# EAGLE board keyBoard_A (EAGLE 6.3), part 1 of 2
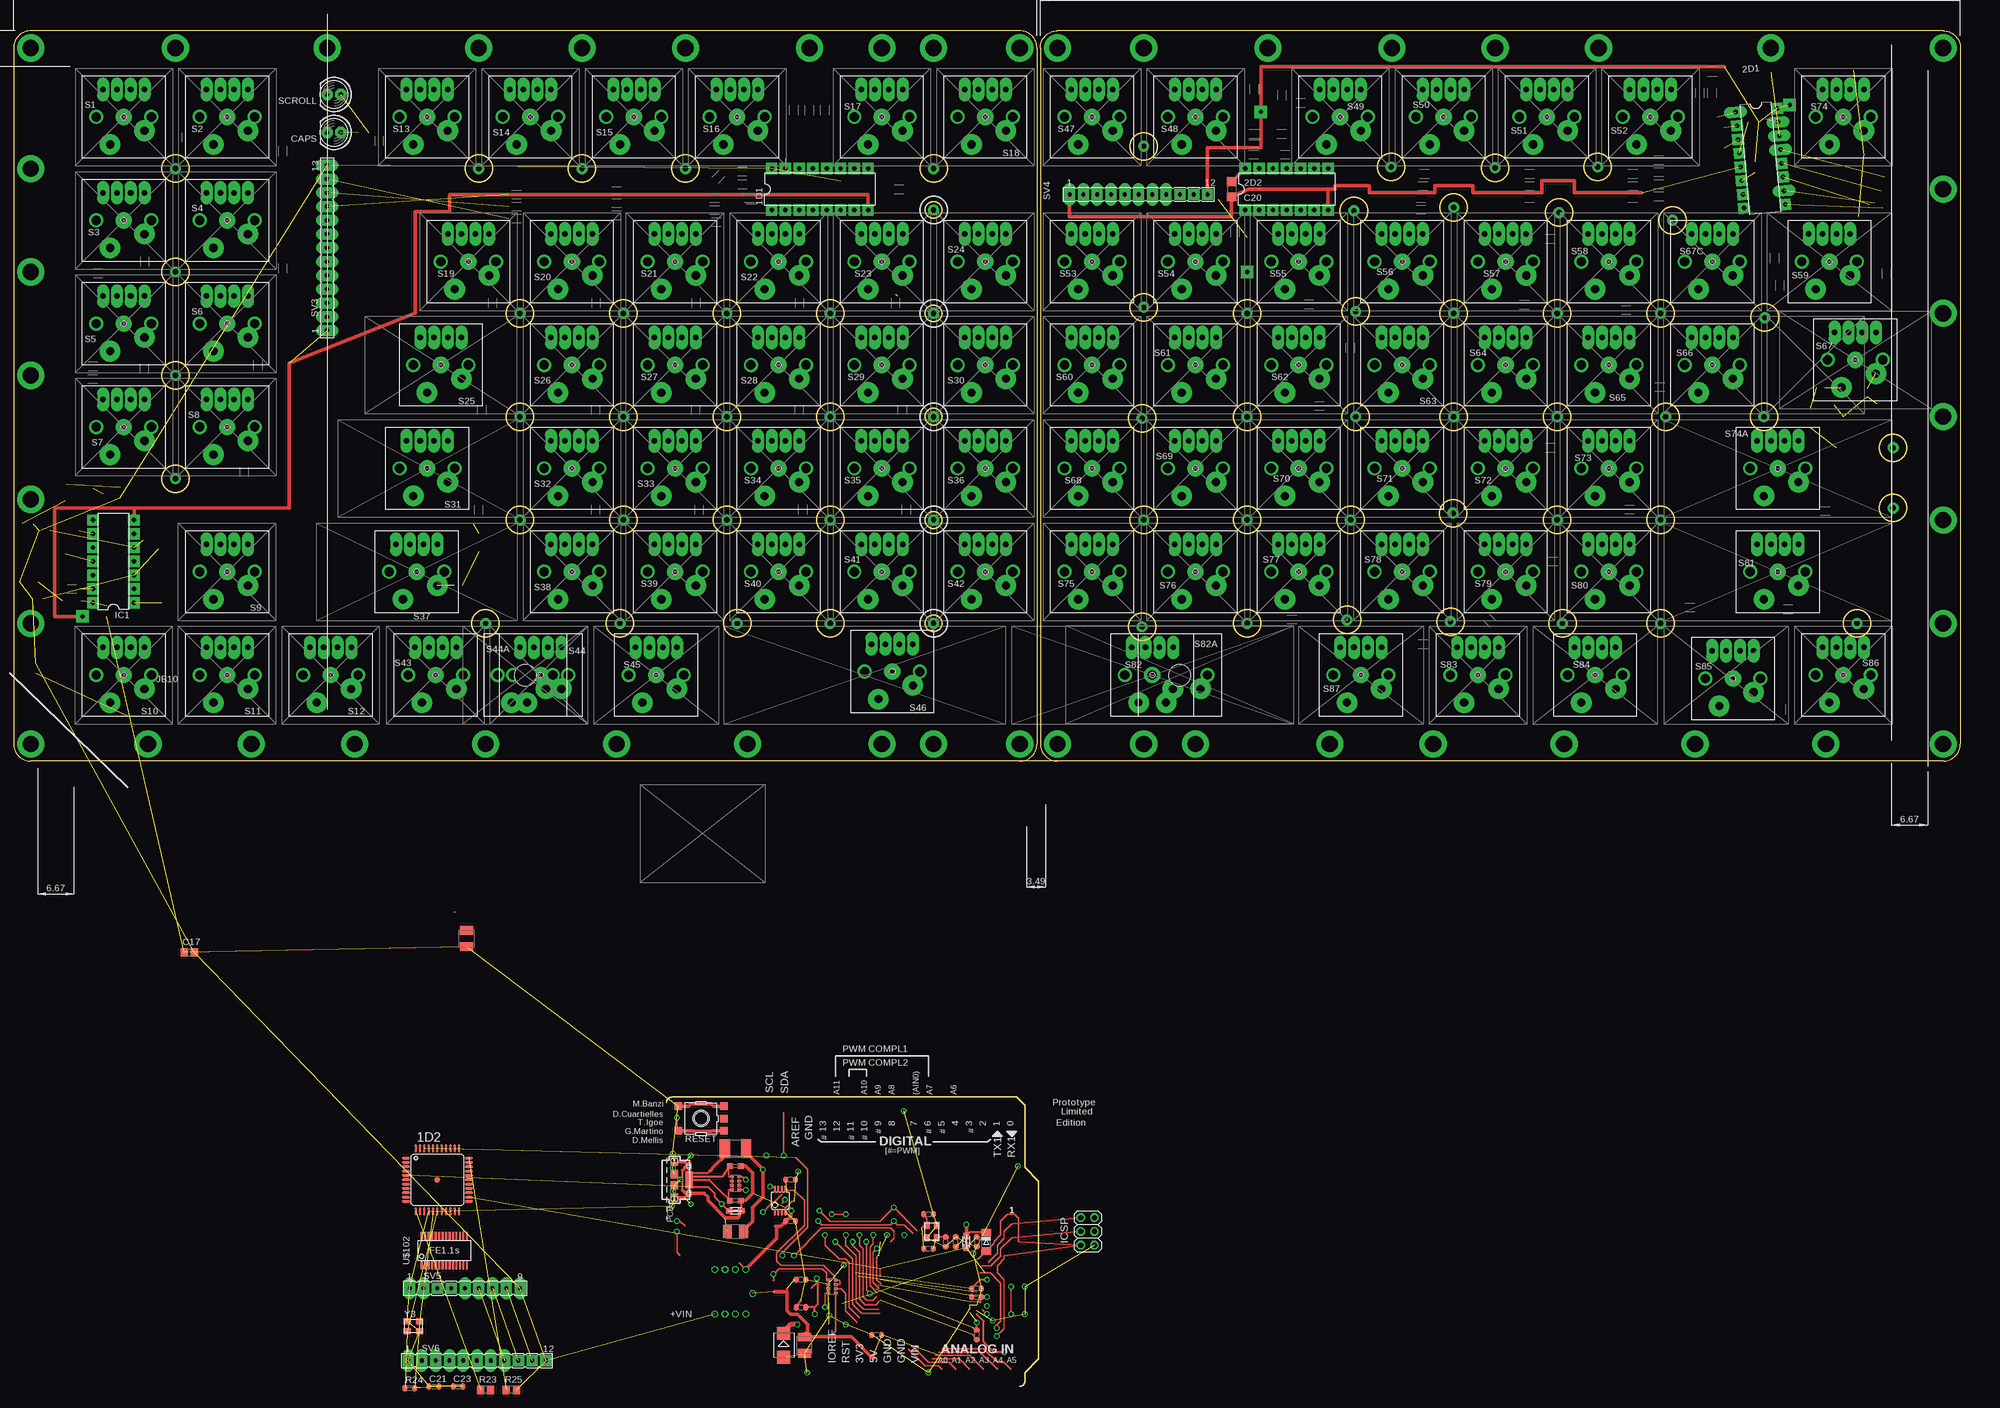
[diagram p4: board, top side]
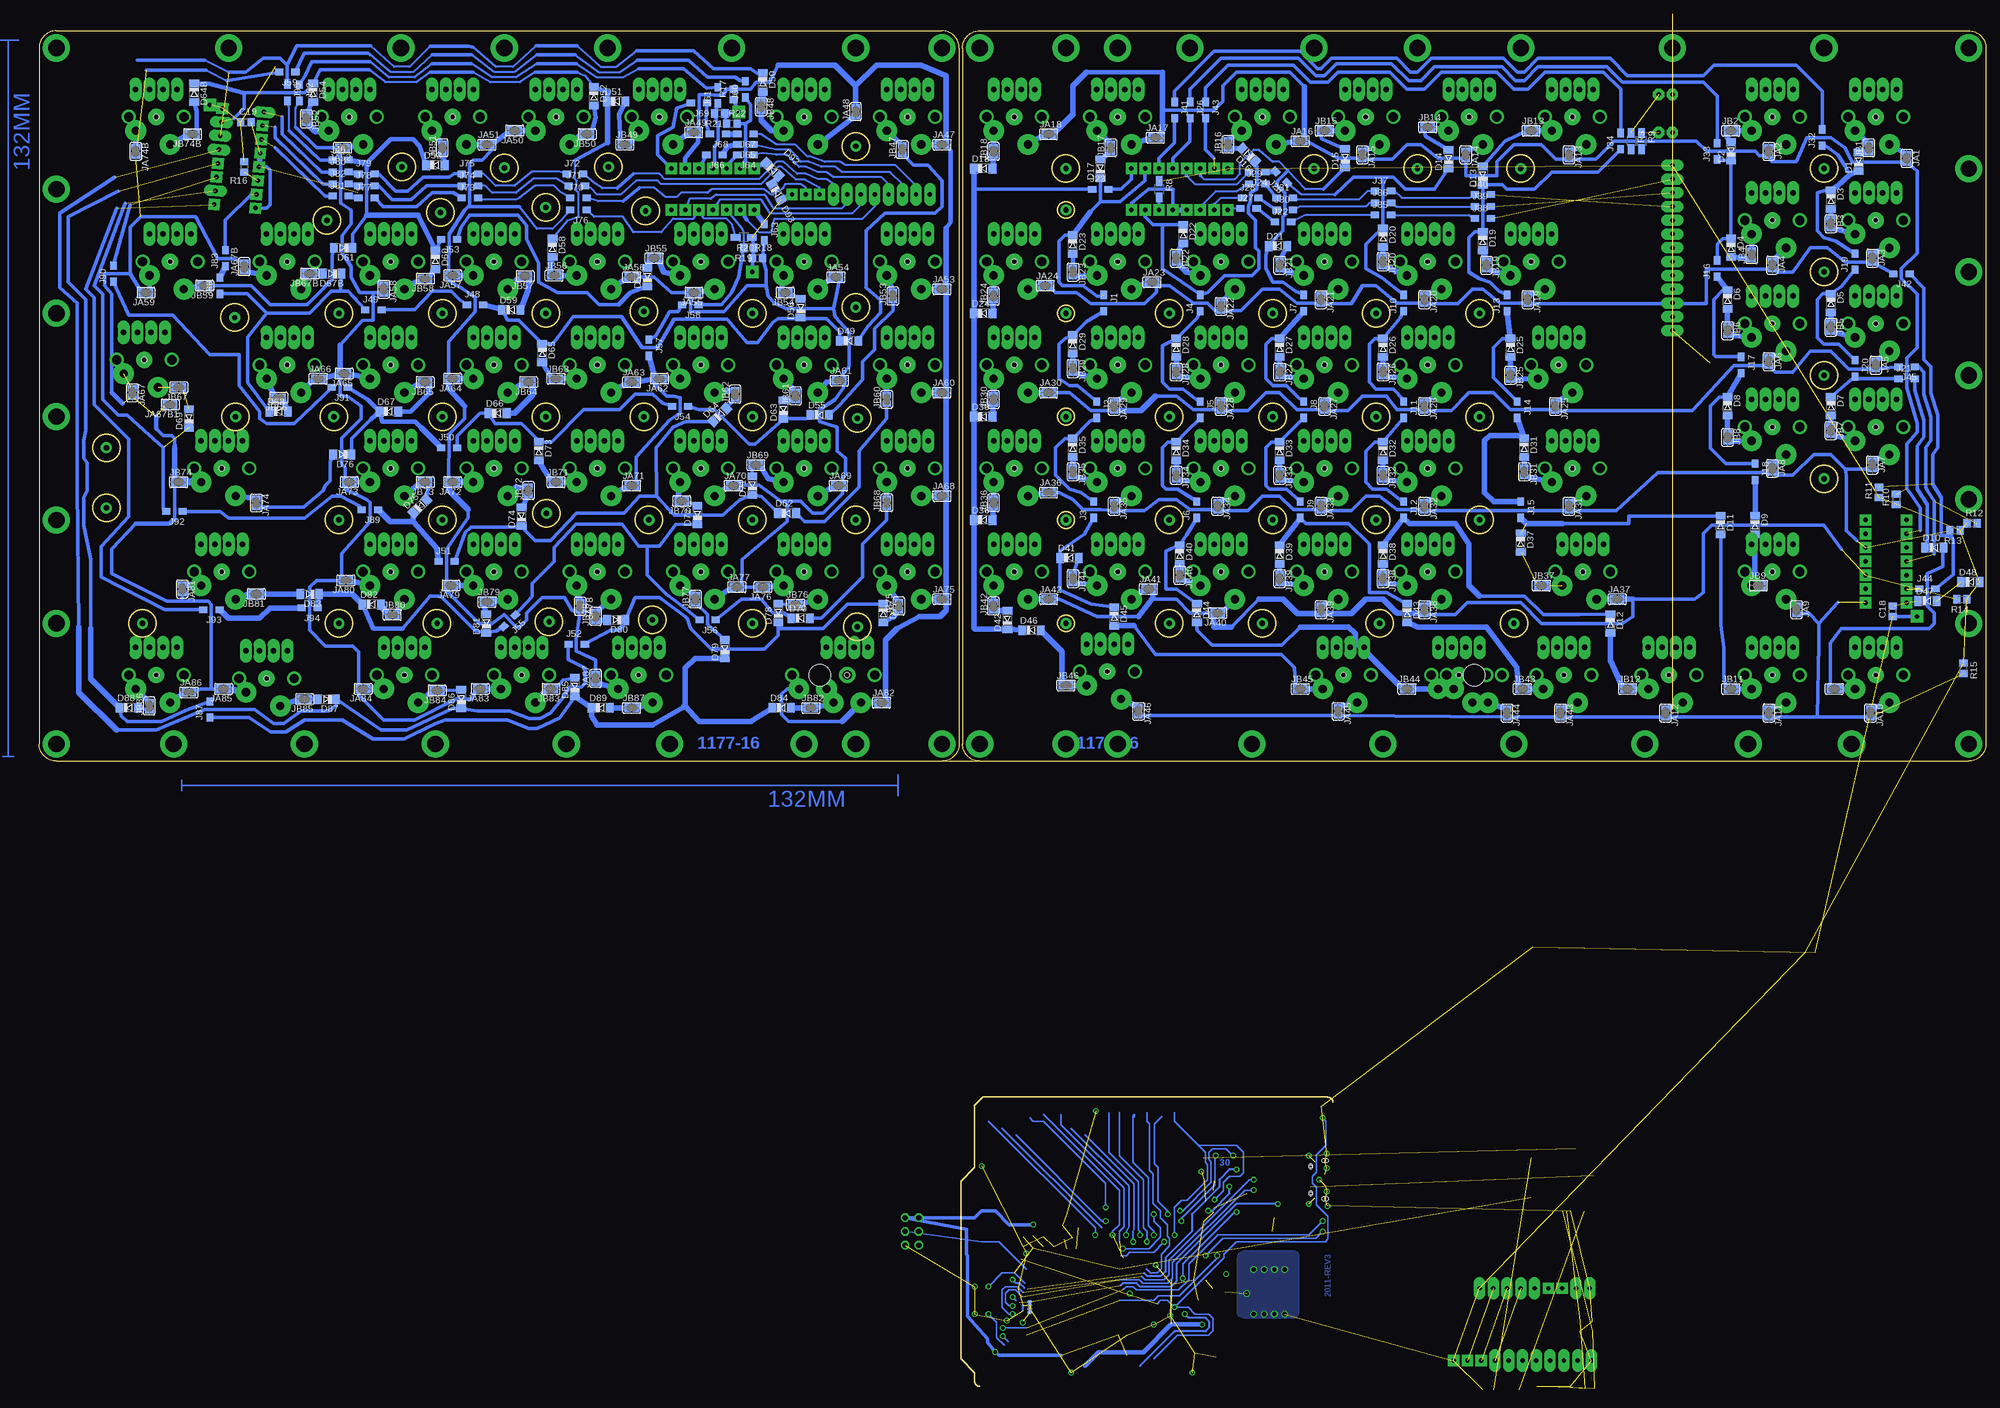
[diagram p5: board, bottom side, seen from below]

Size 358.77 x 253.05 mm. Coordinates in mm from the lower left corner, seen from the top.
Outline: 185.42,115.25 3.17,115.25 arc-90 0,118.43 0,246.7 arc-90 3.17,249.87 185.42,249.87 arc-90 188.59,246.7 188.59,118.43 arc-90 185.42,115.25
Outline: 185.37,0 arc90 186.37,1 186.37,2.54 188.91,5.08 188.91,37.85 186.37,40.39 186.37,51.82 184.85,53.34 121.33,53.34 arc90 120.33,52.34
Outline: 57.78,253.05 57.78,124.78
Outline: 210.82,115.25 185.42,115.25
Outline: 189.23,246.7 189.23,118.43 arc90 192.41,115.25 355.6,115.25 arc90 358.77,118.43 358.77,246.7 arc90 355.6,249.87 192.41,249.87 arc90 189.23,246.7
Outline: circle at 169.54,159.7 radius 1.5
Outline: circle at 169.54,140.65 radius 1.5
Outline: circle at 150.5,140.65 radius 2.5
Outline: circle at 169.54,178.75 radius 1.5
Outline: circle at 169.54,197.8 radius 1.5
Outline: circle at 150.5,197.8 radius 2.5
Outline: circle at 150.5,178.75 radius 2.5
Outline: circle at 150.5,159.7 radius 2.5
Outline: circle at 133.35,140.65 radius 2.5
Outline: circle at 131.44,159.7 radius 2.5
Outline: circle at 131.44,178.75 radius 2.5
Outline: circle at 131.44,197.8 radius 2.5
Outline: circle at 112.39,197.8 radius 2.5
Outline: circle at 112.39,178.75 radius 2.5
Outline: circle at 112.39,159.7 radius 2.5
Outline: circle at 111.76,140.65 radius 2.5
Outline: circle at 93.34,159.7 radius 2.5
Outline: circle at 87,140.65 radius 2.5
Outline: circle at 93.34,178.75 radius 2.5
Outline: circle at 93.34,197.8 radius 2.5
Copper layers (1*16): Top 0.035mm / dielectric 1.5mm / Bottom 0.035mm
Design rules "default": minimum track width 10mil, minimum drill 24mil, track to track 8mil, track to pad 8mil, pad to pad 8mil, via to via 8mil, smd to smd 8mil, copper to edge 40mil, drill to drill 8mil, minimum pad ring 10mil, minimum via ring 8mil, stop-mask expansion 4mil, vias tented up to drill 0mil, thermal gap 10mil
Net classes: 1 power: width 0.254 mm, drill 0.61 mm, clearance 0.254 mm; 2 gnd: width 0.254 mm, drill 0.61 mm, clearance 0.254 mm; 3 usbvcc: width 0.254 mm, drill 0.61 mm, clearance 0.254 mm; 4 aref: width 0.254 mm, drill 0.61 mm, clearance 0.254 mm
vRestrict: area 238.8,16.7 to 239.3,17; area 232,13.3 to 232.7,13.8; area 240.7,13.3 to 241.4,13.8; area 237.5,13.3 to 238,13.8; area 244.1,-11.6 to 244.7,-11.1; area 246.6,-11.7 to 247.1,-10.9

## Footprints (pad centres in the part's own frame; a part is rotated, then mirrored left to right if it is on the bottom)
DIL16 = drill 0.813 pad 2.1 square: 1 -8.89,-3.81; 2 -6.35,-3.81; 3 -3.81,-3.81; 4 -1.27,-3.81; 5 1.27,-3.81; 6 3.81,-3.81; 7 6.35,-3.81; 8 8.89,-3.81; 9 8.89,3.81; 10 6.35,3.81; 11 3.81,3.81; 12 1.27,3.81; 13 -1.27,3.81; 14 -3.81,3.81; 15 -6.35,3.81; 16 -8.89,3.81
SMARTPRJ_TQFP44-PAD = smd 1.4 x 0.45: 1 -5.8,4; 2 -5.8,3.2; 3 -5.8,2.4; 4 -5.8,1.6; 5 -5.8,0.8; 6 -5.8,0; 7 -5.8,-0.8; 8 -5.8,-1.6; 9 -5.8,-2.4; 10 -5.8,-3.2; 11 -5.8,-4; 23 5.8,-4; 24 5.8,-3.2; 25 5.8,-2.4; 26 5.8,-1.6; 27 5.8,-0.8; 28 5.8,0; 29 5.8,0.8; 30 5.8,1.6; 31 5.8,2.4; 32 5.8,3.2; 33 5.8,4 | smd 0.45 x 1.4: 12 -4,-5.8; 13 -3.2,-5.8; 14 -2.4,-5.8; 15 -1.6,-5.8; 16 -0.8,-5.8; 17 0,-5.8; 18 0.8,-5.8; 19 1.6,-5.8; 20 2.4,-5.8; 21 3.2,-5.8; 22 4,-5.8; 34 4,5.8; 35 3.2,5.8; 36 2.4,5.8; 37 1.6,5.8; 38 0.8,5.8; 39 0,5.8; 40 -0.8,5.8; 41 -1.6,5.8; 42 -2.4,5.8; 43 -3.2,5.8; 44 -4,5.8 | smd 1 x 1: P$1 0,0
DIL16' = drill 0.813 pad 2.1 long: 1 -8.89,-3.81; 10 6.35,3.81; 13 -1.27,3.81; 14 -3.81,3.81; 15 -6.35,3.81 | drill 0.813 pad 2.1 square: 2 -6.35,-3.81; 3 -3.81,-3.81; 4 -1.27,-3.81; 5 1.27,-3.81; 6 3.81,-3.81; 7 6.35,-3.81; 8 8.89,-3.81; 9 8.89,3.81; 11 3.81,3.81; 12 1.27,3.81; 16 -8.89,3.81
DIL14 = drill 0.813 pad 2.1 square: 1 -7.62,-3.81; 2 -5.08,-3.81; 3 -2.54,-3.81; 4 0,-3.81; 5 2.54,-3.81; 6 5.08,-3.81; 7 7.62,-3.81; 8 7.62,3.81; 9 5.08,3.81; 10 2.54,3.81; 11 0,3.81; 12 -2.54,3.81; 13 -5.08,3.81; 14 -7.62,3.81
C0603-ROUND = smd 0.898 x 1.1: 1 -0.889,0; 2 0.889,0
SMC_B = smd 1.6 x 2.4: + -1.5,0; - 1.5,0
C0805 = smd 1.3 x 1.5: 1 -0.95,0; 2 0.95,0
C1206 = smd 1.6 x 1.8: 1 -1.4,0; 2 1.4,0
LED5MM = drill 0.813 pad 2.1 octagon: A -1.27,0; K 1.27,0
SOD80C = smd 1.4 x 1.8 bottom: A -1.7,0; C 1.7,0
SMB = smd 2.4 x 2.4: A 2.2,0; C -2.2,0
MINIMELF = smd 1.4 x 1.8: A 1.7,0; C -1.7,0
L1812 = smd 1.9 x 3.4: 1 -1.95,0; 2 1.95,0
MSOP08 = smd 0.3 x 1.2: 1 -0.976,-2.113; 2 -0.326,-2.113; 3 0.324,-2.113; 4 0.974,-2.113; 5 0.974,2.112; 6 0.324,2.112; 7 -0.326,2.112; 8 -0.976,2.112
2X03 = drill 0.95 pad 1.55 octagon: 1 -2.54,-1.27; 2 -2.54,1.27; 3 0,-1.27; 4 0,1.27; 5 2.54,-1.27; 6 2.54,1.27
R1206W = smd 1.5 x 1.2 bottom: 1 1.499,0; 2 -1.499,0
CON2_USB_MICRO_B_AT = smd 0.406 x 1.346: P1 -1.321,2.692; P2 -0.66,2.692; P3 0,2.692; P4 0.66,2.692; P5 1.321,2.692 | smd 1.651 x 1.549: S1 -3.302,0; S2 3.302,0 | smd 1.524 x 1.016: S3 -2.489,2.692; S4 2.489,2.692 | smd 1.524 x 1.524: S5 -1.016,0; S6 1.016,0 | hole 0.7: -3.505,0.254; -3.505,-0.254; 3.505,0.254; 3.505,-0.254; -2.616,2.692; -2.362,2.692; 2.362,2.692; 2.616,2.692
SJ = smd 1.168 x 1.6 bottom: 1 0.762,0; 2 -0.762,0
SJ' = smd 1.168 x 1.6: 1 -0.762,0; 2 0.762,0
0805 = smd 1.2 x 1: 1 -1.1,0; 2 1.1,0
R1206W' = smd 1.8 x 1.2: 1 -1.499,0; 2 1.499,0
R0603-ROUND = smd 0.898 x 1.1: 1 -0.889,0; 2 0.889,0
R0402 = smd 0.7 x 0.9: 1 -0.65,0; 2 0.65,0
M0805 = smd 1.3 x 1.6: 1 -0.95,0; 2 0.95,0
R0805 = smd 1.3 x 1.5: 1 -0.95,0; 2 0.95,0
TS42 = smd 1.6 x 1.4: 1 -4.2,2.25; 2 4.2,2.25; 3 -4.2,-2.25; 4 4.2,-2.25; 5 -4.2,0
CAY16 = smd 0.5 x 0.65: 1 -1.2,-0.675; 2 -0.4,-0.675; 3 0.4,-0.675; 4 1.2,-0.675; 5 1.2,0.675; 6 0.4,0.675; 7 -0.4,0.675; 8 -1.2,0.675
CHERRY-MX-4P = drill 1.016 pad 2.184 long: D1 -3.81,-5.08; D2 3.81,-5.08; LED1 -1.27,-5.08; LED2 1.27,-5.08 | drill 1 pad 3: P$1 0,0 | drill 1.714 pad 1.93: P$3 -5.08,0; P$4 5.08,0 | drill 1.5 pad 3.81: SW1 -3.81,2.54; SW2 2.54,5.08 | hole 1: 0,0
CHERRY-MX = drill 0.8: P$1 0,0 | drill 1.714 pad 1.93: P$3 -5.08,0; P$4 5.08,0 | drill 1.5 pad 3.81: SW1 -3.81,2.54; SW2 2.54,5.08 | hole 4: 0,0
FE13 = drill 0.813 pad 2.1 long: 1 -15.24,0; 2 -12.7,0; 3 -10.16,0; 4 -7.62,0; 5 -5.08,0; 6 -2.54,0; 7 0,0; 8 2.54,0; 9 5.08,0; 10 7.62,0; 11 10.16,0; 12 12.7,0; 13 15.24,0
FE12 = drill 0.813 pad 2.1 long: 1 -13.97,0; 2 -11.43,0; 3 -8.89,0; 4 -6.35,0; 5 -3.81,0; 6 -1.27,0; 7 1.27,0; 8 3.81,0 | drill 0.813 pad 2.1 square: 9 6.35,0; 10 8.89,0; 11 11.43,0
FE09 = drill 0.813 pad 2.1 long: 1 -10.16,0; 2 -7.62,0; 5 0,0; 6 2.54,0; 7 5.08,0; 8 7.62,0; 9 10.16,0 | drill 0.813 pad 2.1 square: 3 -5.08,0; 4 -2.54,0
FE1.1S_SSOP-28 = smd 0.35 x 1.5: 1 -4.16,-2.7; 2 -3.52,-2.7; 3 -2.88,-2.7; 4 -2.24,-2.7; 5 -1.6,-2.7; 6 -0.96,-2.7; 7 -0.32,-2.7; 8 0.32,-2.7; 9 0.96,-2.7; 10 1.6,-2.7; 11 2.24,-2.7; 12 2.88,-2.7; 13 3.52,-2.7; 14 4.16,-2.7; 15 4.16,2.7; 16 3.52,2.7; 17 2.88,2.7; 18 2.24,2.7; 19 1.6,2.7; 20 0.96,2.7; 21 0.32,2.7; 22 -0.3,2.7; 23 -0.96,2.7; 24 -1.6,2.7; 25 -2.24,2.7; 26 -2.88,2.7; 27 -3.52,2.7; 28 -4.16,2.7
CRYSTAL-3.2-2.5 = smd 1.3 x 1.05: 1 -1.15,-0.925; 2 1.15,-0.925; 3 1.15,0.925; 4 -1.15,0.925
CT/CN0603 = smd 1 x 1: 1 -1,0; 2 1,0

## Placement (x,y rotation side)
1D1  74HC138N  [DIL16]  148.59,220.66 0 top
1D2  ATMEGA32U4  [SMARTPRJ_TQFP44-PAD]  78.11,38.1 0 top
2D1  74HC138N  [DIL16']  321.94,226.38 275 top
2D2  74HC04N  [DIL14]  234.63,220.66 0 top
C3  100n  [C0603-ROUND]  173.67,26.67 90 top
C4  100n  [C0603-ROUND]  159.07,9.52 180 top
C5  1uF  [C0603-ROUND]  177.48,26.67 270 top
C6  100n  [C0603-ROUND]  177.48,9.52 270 top
C7  1uF  [C0603-ROUND]  177.48,16.51 0 top
C8  10u  [SMC_B]  133.03,28.57 180 top
C9  100n  [C0603-ROUND]  177.48,18.03 180 top
C10  10u  [SMC_B]  83.5,82.55 270 top
C11  1u  [C0603-ROUND]  145.1,19.69 180 top
C12  10u  [SMC_B]  145.73,7.62 270 top
C13  100n  [C0603-ROUND]  143.19,30.48 0 top
C14  1u  [C0603-ROUND]  145.1,14.6 0 top
C15  22p  [C0603-ROUND]  171.77,26.67 90 top
C16  22p  [C0603-ROUND]  168.59,31.75 0 top
C17  100n  [C0805]  32.38,80.01 0 top
C18  100n  [C0805]  17.14,142.88 90 bottom
C19  100n  [C0805]  320.68,233.04 0 bottom
C20  100n  [C1206]  224.47,220.66 270 top
C21  22p  [C0603-ROUND]  77.47,0 0 top
C22  100n  [C0603-ROUND]  143.19,38.1 180 top
C23  22p  [C0603-ROUND]  81.92,0 0 top
CAPS  [LED5MM]  59.05,231.14 180 top
D1  LL4148  [SOD80C]  23.5,225.74 270 top
D2  LL4148  [SOD80C]  46.99,227.65 270 top
D3  LL4148  [SOD80C]  28.57,218.76 90 top
D4  LL4148  [SOD80C]  46.99,209.87 90 top
D5  LL4148  [SOD80C]  28.57,199.71 90 top
D6  LL4148  [SOD80C]  47.62,200.34 90 top
D7  LL4148  [SOD80C]  28.57,180.66 90 top
D8  LL4148  [SOD80C]  47.62,180.66 90 top
D9  LL4148  [SOD80C]  42.55,158.75 90 top
D10  LL4148  [SOD80C]  9.53,154.62 0 top
D11  LL4148  [SOD80C]  48.9,158.75 90 top
D12  LL4148  [SOD80C]  69.22,140.65 90 top
D13  LL4148  [SOD80C]  92.71,223.2 270 top
D14  LL4148  [SOD80C]  99.06,226.22 270 top
D15  LL4148  [SOD80C]  118.11,226.38 270 top
D16  LL4148  [SOD80C]  135.89,227.01 225 top
D17  LL4148  [SOD80C]  163.19,224.47 270 top
D18  LL4148  [SOD80C]  184.78,224.47 0 top
D19  LL4148  [SOD80C]  92.71,211.14 90 top
D20  LL4148  [SOD80C]  111.12,211.77 90 top
D21  LL4148  [SOD80C]  130.49,210.19 0 top
D22  LL4148  [SOD80C]  147.96,212.41 90 top
D23  LL4148  [SOD80C]  168.28,210.5 90 top
D24  LL4148  [SOD80C]  184.78,197.8 0 top
D25  LL4148  [SOD80C]  87.63,191.45 90 top
D26  LL4148  [SOD80C]  111.12,191.45 90 top
D27  LL4148  [SOD80C]  130.18,191.45 90 top
D28  LL4148  [SOD80C]  149.22,191.45 90 top
D29  LL4148  [SOD80C]  168.28,192.09 90 top
D30  LL4148  [SOD80C]  184.78,178.75 0 top
D31  LL4148  [SOD80C]  85.09,173.04 90 top
D32  LL4148  [SOD80C]  111.12,172.4 90 top
D33  LL4148  [SOD80C]  130.18,172.4 90 top
D34  LL4148  [SOD80C]  149.22,172.4 90 top
D35  LL4148  [SOD80C]  168.28,173.04 90 top
D36  LL4148  [SOD80C]  184.78,159.7 0 top
D37  LL4148  [SOD80C]  85.72,155.57 90 top
D38  LL4148  [SOD80C]  111.12,153.35 90 top
D39  LL4148  [SOD80C]  130.18,153.35 90 top
D40  LL4148  [SOD80C]  148.59,153.35 90 top
D41  LL4148  [SOD80C]  168.91,152.72 0 top
D42  LL4148  [SOD80C]  180.34,141.29 270 top
D43  LL4148  [SOD80C]  106.68,142.56 90 top
D44  LL4148  [SOD80C]  145.41,142.56 90 top
D45  LL4148  [SOD80C]  160.66,141.92 90 top
D46  LL4148  [SOD80C]  175.9,139.38 0 top
D47  LL4148  [SOD80C]  10.79,144.78 0 top
D48  LL4148  [SOD80C]  2.86,148.27 0 top
D49  LL4148  [SOD80C]  209.55,192.72 0 top
D50  LL4148  [SOD80C]  225.43,240.35 90 top
D51  LL4148  [SOD80C]  252.41,236.85 0 top
D52  LL4148  [SOD80C]  256.54,237.81 90 top
D53  LL4148  [SOD80C]  285.75,225.11 0 top
D54  LL4148  [SOD80C]  308.29,238.44 90 top
D55  LL4148  [SOD80C]  214.95,179.07 0 top
D56  LL4148  [SOD80C]  218.44,198.75 270 top
D57  LL4148  [SOD80C]  246.7,204.47 270 top
D58  LL4148  [SOD80C]  264.16,209.87 90 top
D59  LL4148  [SOD80C]  271.78,198.44 0 top
D60  LL4148  [SOD80C]  285.75,207.64 90 top
D61  LL4148  [SOD80C]  302.74,209.87 180 top
D62  LL4148  [SOD80C]  220.98,160.97 0 top
D63  LL4148  [SOD80C]  221.62,180.02 270 top
D64  LL4148  [SOD80C]  233.36,179.07 315 top
D64B  LL4148  [SOD80C]  330.2,238.44 90 top
D65  LL4148  [SOD80C]  266.06,190.5 90 top
D66  LL4148  [SOD80C]  274.32,179.39 0 top
D67  LL4148  [SOD80C]  294.32,179.7 0 top
D67B  LL4148  [SOD80C]  304.8,205.1 180 top
D68  LL4148  [SOD80C]  314.64,179.7 0 top
D69  LL4148  [SOD80C]  331.15,178.44 270 top
D70  LL4148  [SOD80C]  218.44,141.6 0 top
D71  LL4148  [SOD80C]  227.33,166.05 270 top
D72  LL4148  [SOD80C]  237.49,160.65 270 top
D73  LL4148  [SOD80C]  266.7,172.4 90 top
D74  LL4148  [SOD80C]  269.88,160.34 270 top
D75  LL4148  [SOD80C]  288.61,162.24 315 top
D76  LL4148  [SOD80C]  302.89,171.77 180 top
D77  LL4148  [SOD80C]  203.2,142.56 90 top
D78  LL4148  [SOD80C]  222.57,142.56 270 top
D79  LL4148  [SOD80C]  232.41,135.89 270 top
D80  LL4148  [SOD80C]  252.41,141.29 180 top
D81  LL4148  [SOD80C]  276.38,140.65 270 top
D82  LL4148  [SOD80C]  297.5,144.14 0 top
D83  LL4148  [SOD80C]  308.93,146.05 180 top
D84  LL4148  [SOD80C]  221.93,125.09 0 top
D85  LL4148  [SOD80C]  260.03,128.9 270 top
D86  LL4148  [SOD80C]  280.99,126.68 270 top
D87  LL4148  [SOD80C]  305.75,126.68 180 top
D88  LL4148  [SOD80C]  342.26,125.09 0 top
D89  LL4148  [SOD80C]  255.27,125.09 0 top
D90  M7  [SMB]  141.92,7.62 270 top
D91  CD1206-S01575  [MINIMELF]  179.26,26.67 270 top
D92  LL4148  [SOD80C]  223.68,224.31 45 top
D93  LL4148  [SOD80C]  222.88,220.19 60 top
F1  MF-MSMF050-2 500mA  [L1812]  133.03,43.81 180 top
IC1  74HC04N  [DIL14]  18.41,152.08 90 top
IC2  LMV358IDGKR  [MSOP08]  141.29,34.29 0 top
ICSP  ICSP  [2X03]  197.93,28.57 270 top
J1  J  [R1206W]  162.56,199.71 90 top
J2  J  [R1206W]  163.83,180.02 90 top
J3  J  [R1206W]  164.47,161.61 270 top
J4  J  [R1206W]  144.78,199.71 270 top
J5  J  [R1206W]  144.78,180.02 90 top
J6  J  [R1206W]  145.41,161.61 270 top
J7  J  [R1206W]  125.73,199.71 270 top
J8  J  [R1206W]  125.73,180.02 90 top
J9  J  [R1206W]  126.36,161.61 90 top
J10  J  [R1206W]  107.31,199.71 270 top
J11  J  [R1206W]  107.31,180.02 90 top
J12  J  [R1206W]  107.31,161.61 90 top
J13  J  [R1206W]  88.27,199.71 270 top
J14  J  [R1206W]  86.36,180.02 90 top
J15  J  [R1206W]  85.72,161.61 90 top
J16  J  [R1206W]  49.53,206.06 270 top
J17  J  [R1206W]  45.09,188.28 90 top
J18  J  [R1206W]  42.55,168.59 90 top
J19  J  [R1206W]  24.13,207.33 270 top
J20  J  [R1206W]  24.13,187.64 90 top
J21  J  [R1206W]  14.61,185.74 0 top
J22  J  [R1206W]  129.54,214.63 0 top
J23  J  [R1206W]  163.19,220.66 0 top
J24  J  [R1206W]  134.3,223.84 180 top
J25  J  [R1206W]  129.86,222.88 225 top
J26  J  [R1206W]  146.69,235.27 90 top
J27  J  [R1206W]  135.89,217.17 0 top
J28  J  [R1206W]  135.57,219.07 0 top
J29  J  [R1206W]  134.3,221.62 0 top
J30  J  [R1206W]  129.22,216.85 0 top
J31  J  [R1206W]  129.22,219.07 0 top
J32  J  [R1206W]  30.16,230.19 270 top
J33  J  [R1206W]  49.53,227.65 270 top
J34  J  [R1206W]  67.31,229.55 270 top
J35  J  [R1206W]  111.12,215.9 0 top
J36  J  [R1206W]  111.12,218.12 0 top
J37  J  [R1206W]  111.12,220.34 0 top
J38  J  [R1206W]  92.71,215.26 0 top
J39  J  [R1206W]  92.71,217.49 0 top
J40  J  [R1206W]  92.71,219.71 0 top
J41  J  [R1206W]  149.54,235.27 90 top
J42  J  [R1206W]  15.56,205.1 180 top
J43  J  [R1206W]  143.83,235.27 90 top
J44  J  [R1206W]  10.79,147 0 top
J45  J  [R1206W]  14.61,187.96 180 top
J46  [R1206W]  303.21,226.06 0 top
J47  USB MICRO  [CON2_USB_MICRO_B_AT]  121.78,38.1 270 top
J48  [R1206W]  278.45,199.39 0 top
J49  [R1206W]  297.18,198.44 0 top
J50  [R1206W]  283.21,173.04 0 top
J51  [R1206W]  283.69,152.08 0 top
J52  [R1206W]  259.71,136.84 0 top
J53  [R1206W]  283.21,211.45 180 top
J54  [R1206W]  240.66,180.66 180 top
J55  [R1206W]  272.1,141.13 135 top
J56  [R1206W]  235.59,141.29 180 top
J57  [R1206W]  246.38,191.45 90 top
J58  [R1206W]  238.76,199.39 180 top
J59  [R1206W]  313.06,242.25 180 top
J60  [R1206W]  228.6,239.08 270 top
J61  [R1206W]  233.68,237.97 270 top
J62  [R1206W]  310.83,238.44 90 top
J63  [R1206W]  225.11,212.72 90 top
J64  [R1206W]  228.6,227.01 180 top
J65  [R1206W]  228.6,228.92 180 top
J66  [R1206W]  234.31,227.01 180 top
J67  [R1206W]  228.6,230.82 180 top
J68  [R1206W]  233.68,230.82 180 top
J69  [R1206W]  237.17,236.54 180 top
J70  [R1206W]  259.4,219.07 0 top
J71  [R1206W]  259.71,221.3 0 top
J72  [R1206W]  260.03,223.52 0 top
J73  [R1206W]  279.4,219.07 0 top
J74  [R1206W]  279.4,221.3 0 top
J75  [R1206W]  279.4,223.52 0 top
J76  [R1206W]  259.4,216.85 180 top
J77  [R1206W]  298.45,219.07 0 top
J78  [R1206W]  298.45,221.3 0 top
J79  [R1206W]  298.45,223.52 0 top
J80  [R1206W]  303.21,223.84 0 top
J81  [R1206W]  303.21,219.39 0 top
J82  [R1206W]  303.21,221.62 0 top
J83  [R1206W]  324.49,207.96 270 top
J87  [R1206W]  327.34,124.78 270 top
J88  [R1206W]  325.44,202.88 270 top
J89  [R1206W]  297.81,161.61 180 top
J90  [R1206W]  345.12,205.1 270 top
J91  [R1206W]  303.37,184.15 180 top
J92  [R1206W]  333.85,161.29 180 top
J93  [R1206W]  327.02,143.19 180 top
J94  [R1206W]  308.93,143.51 180 top
J95  [R1206W]  313.06,238.44 90 top
JA1  [SJ]  14.61,226.38 90 top
JA2  [SJ]  40.01,227.65 90 top
JA3  [SJ]  20.95,207.96 90 top
JA4  [SJ]  39.37,206.69 90 top
JA5  [SJ]  20.32,188.28 90 top
JA6  [SJ]  40.01,188.91 90 top
JA7  [SJ]  20.95,169.86 90 top
JA8  [SJ]  39.37,169.23 90 top
JA9  [SJ]  34.92,143.19 90 top
JA10  [SJ]  21.27,124.14 90 top
JA11  [SJ]  40.01,124.14 90 top
JA12  [SJ]  59.05,124.14 90 top
JA13  [SJ]  76.83,227.01 90 top
JA14  [SJ]  95.89,227.01 90 top
JA15  [SJ]  114.94,227.01 90 top
JA16  [SJ]  126.36,229.55 0 top
JA17  [SJ]  153.03,230.19 0 top
JA18  [SJ]  172.72,230.82 0 top
JA19  [SJ]  84.45,200.34 90 top
JA20  [SJ]  103.5,200.34 90 top
JA21  [SJ]  122.56,200.34 90 top
JA22  [SJ]  140.97,199.07 90 top
JA23  [SJ]  153.67,203.52 0 top
JA24  [SJ]  173.35,202.88 0 top
JA25  [SJ]  79.38,180.66 90 top
JA26  [SJ]  103.5,180.66 90 top
JA27  [SJ]  121.92,180.66 90 top
JA28  [SJ]  140.97,180.66 90 top
JA29  [SJ]  160.66,180.66 90 top
JA30  [SJ]  172.72,183.2 0 top
JA31  [SJ]  76.83,162.24 90 top
JA32  [SJ]  103.5,162.24 90 top
JA33  [SJ]  122.56,162.24 90 top
JA34  [SJ]  141.6,162.24 90 top
JA35  [SJ]  160.66,162.24 90 top
JA36  [SJ]  172.72,164.78 0 top
JA37  [SJ]  67.94,145.1 0 top
JA38  [SJ]  103.5,143.19 90 top
JA39  [SJ]  122.56,143.19 90 top
JA40  [SJ]  141.6,142.56 180 top
JA41  [SJ]  154.31,147 0 top
JA42  [SJ]  172.72,145.1 0 top
JA43  [SJ]  78.42,124.14 90 top
JA44  [SJ]  88.27,124.14 90 top
JA45  [SJ]  119.38,124.46 90 top
JA46  [SJ]  156.21,124.46 90 top
JA47  [SJ]  192.41,228.92 0 top
JA48  [SJ]  208.28,234.95 270 top
JA49  [SJ]  238.12,231.14 0 top
JA50  [SJ]  271.14,231.46 180 top
JA51  [SJ]  276.23,228.92 0 top
JA52  [SJ]  302.89,228.28 180 top
JA53  [SJ]  192.41,202.25 0 top
JA54  [SJ]  211.93,204.47 0 top
JA55  [SJ]  238.12,201.61 180 top
JA56  [SJ]  249.56,204.47 0 top
JA57  [SJ]  282.57,204.79 180 top
JA58  [SJ]  295.27,202.25 90 top
JA59  [SJ]  339.09,201.61 180 top
JA60  [SJ]  192.41,183.2 0 top
JA61  [SJ]  211.3,185.42 0 top
JA62  [SJ]  244.47,185.74 180 top
JA63  [SJ]  249.56,185.1 0 top
JA64  [SJ]  282.57,185.74 180 top
JA65  [SJ]  302.58,186.69 180 top
JA66  [SJ]  307.34,185.74 0 top
JA67  [SJ]  341.63,183.2 90 top
JA67B  [SJ]  320.99,206.38 270 top
JA67B1  [SJ]  334.64,180.97 180 top
JA68  [SJ]  192.41,164.15 0 top
JA69  [SJ]  211.46,166.05 0 top
JA70  [SJ]  230.82,166.05 0 top
JA71  [SJ]  249.56,166.05 0 top
JA72  [SJ]  282.57,166.69 180 top
JA73  [SJ]  301.62,166.69 180 top
JA74  [SJ]  318.77,162.88 90 top
JA74B  [SJ]  341,227.65 90 top
JA75  [SJ]  192.41,145.1 0 top
JA76  [SJ]  225.43,147.32 180 top
JA77  [SJ]  230.19,147.32 0 top
JA78  [SJ]  259.08,143.83 90 top
JA79  [SJ]  282.89,147.64 180 top
JA80  [SJ]  302.26,148.59 180 top
JA81  [SJ]  332.42,147 90 top
JA82  [SJ]  203.52,126.05 0 top
JA83  [SJ]  277.5,128.59 180 top
JA84  [SJ]  299.08,128.59 180 top
JA85  [SJ]  324.8,128.59 180 top
JA86  [SJ]  331.15,127.95 0 top
JA87  [SJ]  256.22,130.49 270 top
JB1  [SJ]  21.59,228.28 270 top
JB2  [SJ']  46.99,231.46 0 bottom
JB3  [SJ]  28.57,214.31 90 top
JB4  [SJ]  43.18,208.6 270 top
JB5  [SJ']  28.57,195.26 270 bottom
JB6  [SJ]  47.62,194.63 90 top
JB7  [SJ]  28.57,176.21 90 top
JB8  [SJ]  47.62,174.94 90 top
JB9  [SJ]  41.91,147.64 0 top
JB10  [SJ]  27.94,128.59 0 top
JB11  [SJ]  46.99,128.59 0 top
JB12  [SJ]  66.04,128.59 0 top
JB13  [SJ]  83.82,231.46 0 top
JB14  [SJ']  102.87,232.09 0 bottom
JB15  [SJ']  121.92,231.46 0 bottom
JB16  [SJ]  139.7,228.92 270 top
JB17  [SJ]  161.29,228.28 270 top
JB18  [SJ]  182.88,227.65 270 top
JB19  [SJ]  92.08,206.69 90 top
JB20  [SJ]  111.12,207.33 90 top
JB21  [SJ]  130.18,206.69 90 top
JB22  [SJ]  149.22,207.96 90 top
JB23  [SJ]  168.28,205.42 90 top
JB24  [SJ]  182.88,200.98 270 top
JB25  [SJ]  87.63,186.37 90 top
JB26  [SJ]  111.12,187.01 90 top
JB27  [SJ]  130.18,187.01 90 top
JB28  [SJ]  149.22,187.01 90 top
JB29  [SJ]  168.28,187.64 90 top
JB30  [SJ]  182.88,181.93 270 top
JB31  [SJ]  85.09,168.59 90 top
JB32  [SJ]  111.12,167.96 90 top
JB33  [SJ]  130.18,167.96 90 top
JB34  [SJ]  149.22,167.96 90 top
JB35  [SJ]  168.28,168.59 90 top
JB36  [SJ]  182.88,162.88 270 top
JB37  [SJ]  81.92,147.64 0 top
JB38  [SJ]  111.12,148.91 90 top
JB39  [SJ]  130.18,148.91 90 top
JB40  [SJ]  148.59,149.54 90 top
JB41  [SJ]  168.28,148.91 90 top
JB42  [SJ]  182.88,143.83 270 top
JB43  [SJ]  85.41,128.59 0 top
JB44  [SJ]  106.68,128.59 0 top
JB45  [SJ]  126.36,128.59 0 top
JB46  [SJ]  169.54,129.22 0 top
JB47  [SJ]  199.71,227.96 270 top
JB48  [SJ]  225.74,235.9 90 top
JB49  [SJ]  250.82,228.92 0 top
JB50  [SJ]  257.81,230.82 180 top
JB51  [SJ]  284.48,228.28 270 top
JB52  [SJ]  309.56,233.68 90 top
JB53  [SJ]  201.45,200.98 270 top
JB54  [SJ]  221.3,201.61 180 top
JB55  [SJ]  245.43,207.96 0 top
JB56  [SJ]  263.84,204.79 0 top
JB57  [SJ]  269.24,204.63 180 top
JB58  [SJ]  287.65,204.15 180 top
JB59  [SJ]  328.3,202.88 180 top
JB60  [SJ]  202.56,181.93 270 top
JB61  [SJ]  219.39,182.56 270 top
JB62  [SJ]  230.5,182.88 270 top
JB63  [SJ]  263.52,185.74 0 top
JB64  [SJ]  268.61,185.1 180 top
JB65  [SJ]  287.65,185.1 180 top
JB66  [SJ]  314.64,182.25 180 top
JB67  [SJ]  333.06,184.15 180 top
JB67B  [SJ]  308.93,205.1 180 top
JB68  [SJ]  202.56,162.88 270 top
JB69  [SJ]  226.69,169.86 0 top
JB70  [SJ]  240.35,163.19 180 top
JB71  [SJ]  263.52,166.69 0 top
JB72  [SJ]  268.61,165.1 270 top
JB73  [SJ]  287.65,166.69 180 top
JB74  [SJ]  333.06,166.69 0 top
JB74B  [SJ]  330.52,230.82 180 top
JB75  [SJ]  200.34,143.83 270 top
JB76  [SJ]  219.39,144.14 0 top
JB77  [SJ]  237.81,145.1 270 top
JB78  [SJ]  256.22,141.92 270 top
JB79  [SJ]  276.23,144.62 0 top
JB80  [SJ]  293.69,142.24 0 top
JB81  [SJ]  318.77,146.05 180 top
JB82  [SJ]  216.53,125.09 0 top
JB83  [SJ]  264.48,128.59 180 top
JB84  [SJ]  285.43,128.27 180 top
JB85  [SJ]  309.88,126.68 180 top
JB86  [SJ]  338.45,125.41 270 top
JB87  [SJ]  249.56,125.09 0 top
L1  MH2029-300Y  [0805]  175.58,26.67 270 top
L2  MH2029-300Y  [0805]  133.03,32.38 0 top
R3  [R1206W']  65.41,229.55 270 bottom
R4  1M  [R0603-ROUND]  168.59,25.4 0 top
R5  NM  [R0402]  176.21,14.33 90 bottom
R6  NM  [R0402]  176.21,14.96 90 bottom
R8  [R1206W']  152.4,220.66 270 bottom
R9  [R1206W']  63.5,229.55 270 bottom
R10  [M0805]  16.51,163.51 90 bottom
R11  [M0805]  19.68,164.78 90 bottom
R12  [M0805]  2.54,159.07 0 bottom
R13  [M0805]  5.71,157.8 180 bottom
R14  [M0805]  4.45,145.1 180 bottom
R15  [M0805]  4.13,132.4 270 bottom
R16  1k  [R0805]  320.99,224.79 270 bottom
R17  10k  [R0805]  230.82,238.12 90 bottom
R18  10k  [R0805]  226.38,207.96 0 bottom
R19  10k  [R0805]  227.97,209.87 180 bottom
R20  10k  [R1206W']  228.92,211.77 180 bottom
R21  10k  [R0805]  233.36,234.63 180 bottom
R22  10k  [R0805]  231.14,232.73 0 bottom
R23  [M0805]  87,-0.63 0 top
R24  1M  [R0603-ROUND]  73.03,-0.32 0 top
R25  [M0805]  91.76,-0.63 0 top
RESET  TS42  [TS42]  126.68,49.4 180 top
RN1  10K  [CAY16]  150.81,18.41 270 top
RN3  22R  [CAY16]  133.03,37.46 90 top
S1  Scroll Lock  [CHERRY-MX-4P]  20.32,234 180 top
S2  ESC  [CHERRY-MX-4P]  39.37,234 180 top
S3  Ins  [CHERRY-MX-4P]  20.32,214.95 180 top
S4  Pause  [CHERRY-MX-4P]  39.37,214.95 180 top
S5  Home  [CHERRY-MX-4P]  20.32,195.9 180 top
S6  PageUp  [CHERRY-MX-4P]  39.37,195.9 180 top
S7  End  [CHERRY-MX-4P]  20.32,176.85 180 top
S8  PageDown  [CHERRY-MX-4P]  39.37,176.85 180 top
S9  Up  [CHERRY-MX-4P]  39.37,150.18 180 top
S10  Left  [CHERRY-MX-4P]  20.32,131.13 180 top
S11  Down  [CHERRY-MX-4P]  39.37,131.13 180 top
S12  Right  [CHERRY-MX-4P]  58.42,131.13 180 top
S13  F1  [CHERRY-MX-4P]  76.2,234 180 top
S14  F2  [CHERRY-MX-4P]  95.25,234 180 top
S15  F3  [CHERRY-MX-4P]  114.3,234 180 top
S16  F4  [CHERRY-MX-4P]  133.35,234 180 top
S17  F5  [CHERRY-MX-4P]  160.02,234 180 top
S18  F6  [CHERRY-MX-4P]  179.07,234 180 top
S19  1  [CHERRY-MX-4P]  83.82,207.33 180 top
S20  2  [CHERRY-MX-4P]  102.87,207.33 180 top
S21  3  [CHERRY-MX-4P]  121.92,207.33 180 top
S22  4  [CHERRY-MX-4P]  140.97,207.33 180 top
S23  5  [CHERRY-MX-4P]  160.02,207.33 180 top
S24  6  [CHERRY-MX-4P]  179.07,207.33 180 top
S25  TAB  [CHERRY-MX-4P]  78.74,188.28 180 top
S26  Q  [CHERRY-MX-4P]  102.87,188.28 180 top
S27  W  [CHERRY-MX-4P]  121.92,188.28 180 top
S28  E  [CHERRY-MX-4P]  140.97,188.28 180 top
S29  R  [CHERRY-MX-4P]  160.02,188.28 180 top
S30  T  [CHERRY-MX-4P]  179.07,188.28 180 top
S31  LCtrl  [CHERRY-MX-4P]  76.2,169.23 180 top
S32  A  [CHERRY-MX-4P]  102.87,169.23 180 top
S33  S  [CHERRY-MX-4P]  121.92,169.23 180 top
S34  D  [CHERRY-MX-4P]  140.97,169.23 180 top
S35  F  [CHERRY-MX-4P]  160.02,169.23 180 top
S36  G  [CHERRY-MX-4P]  179.07,169.23 180 top
S37  L Shift  [CHERRY-MX-4P]  74.3,150.18 180 top
S38  Z  [CHERRY-MX-4P]  102.87,150.18 180 top
S39  X  [CHERRY-MX-4P]  121.92,150.18 180 top
S40  C  [CHERRY-MX-4P]  140.97,150.18 180 top
S41  V  [CHERRY-MX-4P]  160.02,150.18 180 top
S42  B  [CHERRY-MX-4P]  179.07,150.18 180 top
S43  Caps Lock  [CHERRY-MX-4P]  77.79,131.13 180 top
S44  FN1  [CHERRY-MX-4P]  97.16,131.13 180 top
S44A  Fn1  [CHERRY-MX]  94.3,131.13 180 top
S45  L_Alt  [CHERRY-MX-4P]  118.43,131.13 180 top
S46  Space  [CHERRY-MX-4P]  161.93,131.76 180 top
S47  F7  [CHERRY-MX-4P]  198.75,234 180 top
S48  F8  [CHERRY-MX-4P]  217.81,234 180 top
S49  F9  [CHERRY-MX-4P]  244.47,234 180 top
S50  F10  [CHERRY-MX-4P]  263.52,234 180 top
S51  F11  [CHERRY-MX-4P]  282.57,234 180 top
S52  F12  [CHERRY-MX-4P]  301.62,234 180 top
S53  7  [CHERRY-MX-4P]  198.75,207.33 180 top
S54  8  [CHERRY-MX-4P]  217.81,207.33 180 top
S55  9  [CHERRY-MX-4P]  236.85,207.33 180 top
S56  0  [CHERRY-MX-4P]  255.91,207.33 180 top
S57  -  [CHERRY-MX-4P]  274.95,207.33 180 top
S58  =  [CHERRY-MX-4P]  294,207.33 180 top
S59  BS  [CHERRY-MX-4P]  334.64,207.33 180 top
S60  Y  [CHERRY-MX-4P]  198.75,188.28 180 top
S61  U  [CHERRY-MX-4P]  217.81,188.28 180 top
S62  I  [CHERRY-MX-4P]  236.85,188.28 180 top
S63  O  [CHERRY-MX-4P]  255.91,188.28 180 top
S64  P  [CHERRY-MX-4P]  274.95,188.28 180 top
S65  [  [CHERRY-MX-4P]  294,188.28 180 top
S66  ]  [CHERRY-MX-4P]  313.06,188.28 180 top
S67  |d  [CHERRY-MX-4P]  339.41,189.23 180 top
S67B  |u  [CHERRY-MX]  392.11,184.78 180 top  (outside the outline)
S67C  |u  [CHERRY-MX-4P]  313.06,207.33 180 top
S68  H  [CHERRY-MX-4P]  198.75,169.23 180 top
S69  J  [CHERRY-MX-4P]  217.81,169.23 180 top
S70  K  [CHERRY-MX-4P]  236.85,169.23 180 top
S71  L  [CHERRY-MX-4P]  255.91,169.23 180 top
S72  :  [CHERRY-MX-4P]  274.95,169.23 180 top
S73  "  [CHERRY-MX-4P]  294,169.23 180 top
S74  Del  [CHERRY-MX-4P]  337.19,234 180 top
S74A  Enter  [CHERRY-MX-4P]  325.12,169.23 180 top
S75  N  [CHERRY-MX-4P]  198.75,150.18 180 top
S76  M  [CHERRY-MX-4P]  217.81,150.18 180 top
S77  <  [CHERRY-MX-4P]  236.85,150.18 180 top
S78  >  [CHERRY-MX-4P]  255.91,150.18 180 top
S79  ~  [CHERRY-MX-4P]  274.95,150.18 180 top
S80  ?  [CHERRY-MX-4P]  294,150.18 180 top
S81  R Shift  [CHERRY-MX-4P]  325.12,150.18 180 top
S82  Space  [CHERRY-MX-4P]  209.87,131.13 180 top
S82A  space  [CHERRY-MX]  214.95,131.13 180 top
S83  FN3  [CHERRY-MX-4P]  269.88,131.13 180 top
S84  R_Alt  [CHERRY-MX-4P]  291.46,131.13 180 top
S85  RCtrl  [CHERRY-MX-4P]  316.87,130.49 180 top
S86  PrtScr  [CHERRY-MX-4P]  337.19,131.13 180 top
S87  FN2  [CHERRY-MX-4P]  248.28,131.13 180 top
SCROLL  [LED5MM]  59.05,238.12 180 top
SV3  [FE13]  57.78,209.87 90 top
SV4  CON_KB_B  [FE12]  208.6,219.71 0 top
SV5  CON_KB_N  [FE09]  83.19,18.1 0 top
SV6  [FE12]  86.68,4.76 0 top
U$1  [18X18]  19.05,235.27 0 top
U$2  [18X18]  38.1,235.27 0 top
U$3  [18X18]  19.05,216.22 0 top
U$4  [18X18]  19.05,197.17 0 top
U$5  [18X18]  38.1,216.22 0 top
U$6  [18X18]  19.05,178.12 0 top
U$7  [18X18]  38.1,197.17 0 top
U$8  [18X18]  38.1,178.12 0 top
U$9  [18X18]  76.52,129.86 90 top
U$10  [18X18]  38.1,129.86 90 top
U$11  [18X18]  38.1,148.91 90 top
U$12  [18X18]  120.65,148.91 90 top
U$13  [18X18]  19.05,129.86 90 top
U$15  [18X23]  127,101.92 0 top
U$16  [18X23]  118.43,131.13 0 top
U$17  [18X52]  156.84,131.13 0 top
U$18  [18X18]  101.6,151.45 0 top
U$19  [18X18]  177.8,151.45 0 top
U$20  [18X18]  158.75,151.45 0 top
U$21  [18X18]  139.7,151.45 0 top
U$22  [18X37]  74.3,150.18 0 top
U$23  [18X18]  120.65,167.96 90 top
U$24  [18X18]  101.6,170.5 0 top
U$25  [18X18]  177.8,170.5 0 top
U$26  [18X18]  158.75,170.5 0 top
U$27  [18X18]  139.7,170.5 0 top
U$28  [18X33]  76.2,169.23 0 top
U$29  [18X18]  120.65,187.01 90 top
U$30  [18X18]  101.6,189.55 0 top
U$31  [18X18]  177.8,189.55 0 top
U$32  [18X18]  158.75,189.55 0 top
U$33  [18X18]  139.7,189.55 0 top
U$34  [18X28]  78.74,188.28 0 top
U$35  [18X18]  120.65,206.06 90 top
U$36  [18X18]  101.6,208.6 0 top
U$37  [18X18]  177.8,208.6 0 top
U$38  [18X18]  158.75,208.6 0 top
U$39  [18X18]  139.7,208.6 0 top
U$40  [18X18]  82.55,208.6 0 top
U$41  [18X18]  177.8,235.27 0 top
U$42  [18X18]  158.75,235.27 0 top
U$43  [18X18]  113.03,235.27 0 top
U$44  [18X18]  132.08,235.27 0 top
U$45  [18X18]  93.98,235.27 0 top
U$46  [18X18]  74.93,235.27 0 top
U$52  [18X42]  325.12,150.18 0 top
U$53  [18X18]  197.49,235.27 0 top
U$54  [18X18]  216.53,235.27 0 top
U$55  [18X18]  281.31,235.27 0 top
U$56  [18X18]  243.21,235.27 0 top
U$57  [18X18]  262.25,235.27 0 top
U$58  [18X18]  300.36,235.27 0 top
U$59  [18X18]  197.49,208.6 0 top
U$60  [18X18]  216.53,208.6 0 top
U$61  [18X18]  235.59,208.6 0 top
U$62  [18X18]  254.63,208.6 0 top
U$63  [18X18]  273.69,208.6 0 top
U$64  [18X18]  292.74,208.6 0 top
U$65  [18X18]  197.49,189.55 0 top
U$66  [18X18]  216.53,189.55 0 top
U$67  [18X18]  235.59,189.55 0 top
U$68  [18X18]  254.63,189.55 0 top
U$69  [18X18]  273.69,189.55 0 top
U$70  [18X18]  292.74,189.55 0 top
U$71  [18X18]  311.79,189.55 0 top
U$72  [18X18]  330.83,189.55 0 top
U$73  [18X18]  197.49,170.5 0 top
U$74  [18X18]  216.53,170.5 0 top
U$75  [18X18]  235.59,170.5 0 top
U$76  [18X18]  254.63,170.5 0 top
U$77  [18X18]  273.69,170.5 0 top
U$78  [18X18]  292.74,170.5 0 top
U$79  [18X18]  197.49,151.45 0 top
U$80  [18X18]  216.53,151.45 0 top
U$81  [18X18]  335.92,235.27 0 top
U$82  [18X18]  57.15,132.4 0 top
U$83  [18X18]  235.59,151.45 0 top
U$84  [18X18]  254.63,151.45 0 top
U$85  [18X18]  273.69,151.45 0 top
U$86  [18X18]  292.74,151.45 0 top
U$87  [18X52]  209.87,131.13 0 top
U$88  [18X37]  401,247.33 0 top  (outside the outline)
U$89  [18X18]  335.92,132.4 0 top
U$90  [18X23]  315.6,131.13 0 top
U$91  [18X23]  94.3,131.13 0 top
U$92  [18X23]  291.46,131.13 0 top
U$93  [18X23]  248.28,131.13 0 top
U$94  [18X42]  325.12,169.23 0 top
U$95  [18X18]  268.61,132.4 0 top
U$96  [18X28]  339.41,189.23 0 top
U$97  [SIZE132]  264.48,110.81 90 top
U$98  [18X18]  95.57,129.86 90 top
U$99  [18X18]  330.83,189.55 0 top
U$101  [18X18]  311.79,208.6 0 top
U$102  FE1.1S  [FE1.1S_SSOP-28]  79.38,25.08 0 top
U$103  [18X23]  334.64,207.33 0 top
U$105  [18X42]  214.95,131.13 180 top
U$165  [SIZE132]  364.49,184.15 0 top  (outside the outline)
Y1  16MHz KX-7  [CRYSTAL-3.2-2.5]  169.23,28.57 270 top
Y3  16MHz KX-7  [CRYSTAL-3.2-2.5]  73.66,11.11 0 top
Z1  CG0603MLC-05E  [CT/CN0603]  133.03,34.29 0 top
Z2  CG0603MLC-05E  [CT/CN0603]  133.03,40.64 0 top

## Tracks (layer width: path | path; a pad name or v marks a point on that pad's centre or on a via)
1
  Bottom 0.61: D3.C 29.41,220.46 31.11,220.03 31.11,213.04 29.84,211.77 27.71,211.14 J19.2 | J32.1 29.62,228.69 27.3,227.01 26.04,224.98 25.06,223.37
  Bottom 1.016: D1.C 25.06,223.37 27.3,221.3 D3.C
1J
  Bottom 0.61: J19.1 26.65,202.68 D5.C 30.05,201.41 31.11,200.34 31.11,193.36 29.84,192.09 27.08,192.09 J20.1
1J2
  Bottom 0.61: D7.C J20.2 23.72,185.74 J21.1
1J3
  Bottom 0.61: J21.2 13.11,183.6 11.43,178.12 11.43,174.94 12.7,173.35 12.7,165.42 10.79,162.56 10.79,155.37 D10.C
2
  Bottom 0.61: J16.2 49.53,210.5 48.47,211.57 D4.C D2.C J33.1
2I  (1 unrouted)
  Bottom 0.406: 267.22,247.13 271.46,243.2 274.64,243.2 278.76,246.81 | 259.6,247.13 255.27,243.2 252.41,243.2 248.72,246.17 | 286.7,247.01 290.51,243.2 293.37,243.2 297.7,247.13 | 323.85,242.25 328.3,244.48
  Bottom 0.61: D50.C 226.49,242.05 227.65,242.89 234.52,242.89 238.12,246.17 248.72,246.17 | 267.22,247.13 259.6,247.13 | 297.7,247.13 311.36,247.13 313.06,243.52 | 278.76,246.81 279.61,247.01 286.7,247.01 | 340.68,244.48 328.3,244.48 | 313.06,243.52 314.32,244.79 317.5,244.79 320.68,242.25 323.85,242.25 | 313.06,243.52 J95.1
2J
  Bottom 0.61: J17.1 49.76,189.78 50.16,190.18 50.16,200.34 48.47,202.04 D6.C
  Bottom 1.016: J16.1 D6.C
2J2
  Bottom 0.61: D8.C 49.1,182.36 50.8,180.66 50.8,172.95 47.94,170.09 J18.1
  Bottom 1.016: D8.C J17.2
2J3
  Bottom 1.016: D9.C J18.2
3
  Bottom 0.61: J13.2 89.76,201.84 91.44,203.52 93.34,204.15 95.25,205.42 95.25,211.77 94.19,212.84 D19.C D13.C 89.11,221.5 88.27,220.66 83.19,220.66 80.01,223.84 71.53,223.84 J34.1
3J
  Bottom 0.61: D25.C 89.11,193.15 90.81,191.45 90.81,185.97 J14.1
  Bottom 1.016: J13.1 D25.C
3J2
  Bottom 1.016: J14.2 D31.C 85.61,175.26 91.44,175.26 92.39,174.31 92.39,164.78 90.72,163.11 J15.1
3J3  (1 unrouted)
  Bottom 0.61: 78.11,159.07 65.83,159.07 65.83,160.45 D11.C
  Bottom 1.016: J15.2 84.68,159.07 78.11,159.07
4
  Bottom 0.406: 120.02,219.71 126.14,219.71 J25.1
  Bottom 0.61: J10.2 111.35,204.38 114.3,206.06 114.3,210.5 112.6,212.2 D20.C 111.12,222.89 | 120.02,219.71 116.52,222.89 111.12,222.89 | 111.12,222.89 109.22,222.89 107,220.66 101.6,220.66 D14.C
4J
  Bottom 0.61: J10.1 107.95,196.96 D26.C 112.6,193.15 113.67,192.09 113.67,185.1 112.39,183.83 109.22,183.83 107.31,181.93 J11.1
4J2
  Bottom 0.61: J11.2 D32.C 112.6,174.1 114.3,172.4 114.3,166.69 113.03,165.42 110.49,165.42 107.54,163.11 J12.1
4J3
  Bottom 0.61: 93.34,145.73 85.09,145.73 81.6,142.24 75.04,142.24 D12.C
  Bottom 1.016: D38.C J12.2 106.27,159.07 97.79,159.07 95.25,155.26 95.25,147.64 93.34,145.73
5
  Bottom 0.406: 122.12,220.66 125.41,220.66 128.64,224.09 130.18,225.74 131.44,225.74 133.99,227.96 134.94,227.96 137.48,225.42 137.48,223.52 138.43,222.57 144.15,222.57 144.78,223.2
  Bottom 0.61: J7.2 127.23,201.84 129.54,203.52 131.44,203.52 132.72,206.06 132.72,208.6 D21.C 132.19,210.39 129.54,213.04 129.54,215.58 129.22,215.9 129.22,220.03 130.81,221.3 130.49,222.23 128.64,224.09 | 122.12,220.66 D15.C | 1D1.14 144.78,223.2
5J
  Bottom 0.61: J8.1 126.59,182.16 128.91,184.47 131.44,184.47 132.72,185.74 132.72,192.09 131.65,193.15 D27.C
  Bottom 1.016: J7.1 D27.C
5J2
  Bottom 0.61: J8.2 125.75,178.52 D33.C 131.65,174.1 132.72,173.04 132.72,166.05 132.08,165.42 128.91,165.42 J9.1
5J3
  Bottom 0.61: D43.C 110.49,146.37 113.67,146.37 113.67,155.26 117.47,159.07 125.32,159.07 J9.2
  Bottom 1.016: J9.2 D39.C
6
  Bottom 0.61: 151.76,214.11 151.76,206.06 J4.2 143.51,201.61 140.34,204.79 135.25,204.79 133.99,206.06 133.99,209.23 134.62,209.87 134.62,214.95 135.89,216.22 135.89,217.49 135.57,218.44 135.57,220.03 134.3,220.66 134.3,224.79 134.51,225.31 D16.C | 151.76,214.11 D22.C | 151.76,214.11 153.47,214.11 154.94,215.58 1D1.7
6J
  Bottom 0.61: J4.1 145.41,196.94 D28.C 151.76,191.88 151.76,185.1 150.5,183.83 147.96,183.83 145.01,181.52 J5.1
6J2
  Bottom 0.61: J5.2 147.32,176.01 D34.C 150.7,174.1 151.76,173.04 151.76,166.05 151.13,165.42 149,165.42 J6.2
6J3
  Bottom 0.61: J6.1 147.32,156.96 D40.C 151.13,153.99 151.13,147 149.22,147 D44.C
7
  Bottom 0.61: J1.2 165.74,196.3 D29.C 169.75,193.15 170.81,192.09 170.81,185.74 168.91,184.47 167.41,184.47 J2.1
7J  (1 unrouted)
  Bottom 0.61: D23.C 169.75,212.2 170.81,211.14 170.81,203.52 170.18,202.88 166.37,202.88 163.83,200.98 162.97,200.98 | 163.19,218.33 159.6,218.33 158.43,219.39 154.94,222.25 1D1.10 | D17.C 163.19,218.33 | 163.19,218.33 165.1,216.42
  Bottom 1.016: 165.1,216.42 D23.C
7J2
  Bottom 0.61: J2.2 165.1,177.91 D35.C 169.75,174.74 171.45,173.04 171.45,167.96 168.91,165.42 166.78,164.78 J3.2
7J3
  Bottom 0.61: D45.C 164.9,144.26 170.61,146.8 D41.C 170.63,153.96 166.16,157.14 J3.1
8
  Bottom 0.61: J23.1 186.49,220.66
  Bottom 1.016: D18.C 186.49,220.66 D24.C D30.C D36.C 186.49,139.81 186.26,139.59 D42.C D46.C
8J
  Bottom 0.61: D85.C 262.89,123.19 267.02,121.28 268.61,121.28 272.42,122.87 283.96,122.87 285.75,122.24 291.46,119.38 297.18,119.38 302.89,122.87 309.88,122.87 313.37,120.65 316.14,120.65 320.04,123.28 J87.1
  Bottom 1.016: 240.12,125.11 245.75,121.92 255.91,121.92 256.97,123.62 D89.C D85.C | 240.12,125.11 239.71,125.41 237.17,122.56 227.65,122.56 | 227.53,122.56 227.65,122.56 | D84.C 227.65,122.56 | D79.C 237.92,134.19 239.71,132.4 239.71,125.52 240.12,125.11
+3V3  (via drill 0.61)
  Top 0.305: 141.61,35.38 139.89,33.65 139.64,33.65 v138.11,32.13 | 148.02,19.05 146.94,18.09
  Top 0.406: 147.64,14.6 C14.2 | 147.64,14.6 148.27,15.24 148.27,18.92 148.02,19.05 v148.02,19.94 | v147.64,13.33 147.64,14.6
  Bottom 0.305: v138.11,32.13 138.24,32.13 138.37,32 138.62,32 148.02,22.61 v148.02,19.94
  Bottom 0.406: 155.89,3.81 149.54,10.16 143.83,10.16 143.19,10.8 143.19,12.07 143.83,12.7 147,12.7 v147.64,13.33
+3VD
  Top 0.61: C20.1 2D2.14
  Bottom 1.016: D92.C 2D2.14
+5V  (via drill 0.61, 0.81)  (21 unrouted)
  Top 0.305: v134.94,21.59 133.71,22.82 | IC2.8 140.31,36.83 v139.42,36.83 | RN1.5 151.49,10.2 150.81,9.52 150.81,9.12
  Top 0.406: 142.56,17.46 142.56,18.09 | 143.8,19.67 C11.2 | v182.56,6.35 180.66,6.35 178.75,8.26 178.75,12.07 177.48,13.33 | 145.33,9.12 C12.+ | D91.C 179.13,28.45 179.08,28.5 176.3,28.5 L1.1
  Top 0.61: 140.26,17.46 142.56,17.46 142.56,13.97 143.19,13.33 144.46,13.33 146.37,11.43 146.37,10.16 145.33,9.12 | v134.94,21.59 140.65,27.31 140.65,29.26 140.4,29.51 141.34,29.51 C13.1 143.32,31.5 v143.32,32.39 | C12.+ 150.81,9.12 154.39,9.12 158.43,5.08 158.43,5.71 | v175.58,29.84 L1.1
  Bottom 0.406: v143.32,32.39 142.56,32.39 139.38,35.56 139.38,36.54 v139.42,36.83
  Bottom 0.61: v175.58,29.84 180.02,29.84 182.56,32.39 185.1,32.39 186.37,31.12 ICSP.2 187.9,28.96 187.9,24.38 187.64,24.13 187.64,12.95 183.96,8.76 183.96,8.13 v182.56,6.35 181.93,5.71 170.5,5.71
  other vias: 129.22,21.59 134.94,13.33 131.13,21.59 133.03,21.59 136.21,17.14 129.22,13.33 131.13,13.33 133.03,13.33
  pour Bottom (isolate 0.406, no thermals): 136.35,25.02 arc-90 137.99,23.38 137.99,13.7 arc-90 136.35,12.7 127.68,12.7 arc-90 126.68,13.7 126.68,24.02 arc-90 127.68,25.02
+5V_B  (via drill 0.8 pad 2.3)  (5 unrouted)
  Top 0.61: 315.28,243.2 229.87,243.2 v229.87,234.95 229.87,228.28 220.03,228.28 SV4.11
  Bottom 0.61: R20.1 R19.1 R18.1 v227.33,205.42 | R17.1 v229.87,234.95 R21.1 R22.1 | 327.01,236.2 v327.34,236.22
  Bottom 1.016: D93.A SV4.11
A0
  Top 0.305: 171.13,3.18 170.5,3.81 167.96,3.81 164.92,6.84
A1
  Top 0.305: 165.72,7.32 168.59,4.45 172.4,4.45 173.67,3.18
A2
  Top 0.305: 169.23,5.08 174.31,5.08 176.21,3.18
A3
  Top 0.305: 169.86,5.71 176.21,5.71 178.75,3.18
A4
  Top 0.305: 170.5,6.35 178.12,6.35 181.29,3.18
A5
  Top 0.305: 171.13,6.99 178.75,6.99 181.29,4.45 182.56,4.45 183.83,3.18
AFN1A
  Bottom 1.016: JB44.2 S44.SW1 S44A.SW1
AFN1B
  Bottom 1.016: JA44.1 S44A.SW2 S44.SW2
AGND  (via drill 0.61)  (1 unrouted)
  Top 0.305: 176.85,10.8 177.47,10.16 C6.1 v177.48,11.79
  Bottom 0.406: v177.48,11.79 177.48,12.07
AREF  (via drill 0.61)  (2 unrouted)
  Top 0.305: v141.67,24.13 141.67,24.64 146.37,29.34 146.37,40.01 144.21,42.16 | 176.86,9.52 C6.2
  Bottom 0.305: v141.67,24.13 141.67,23.75 148.65,16.76 152.46,16.76 153.35,15.88 159.7,15.88
AVCC  (via drill 0.61)  (4 unrouted)
  Top 0.305: 159.7,20.32 159.7,21.72 | v183.83,18.41 v183.83,13.33
  Bottom 0.305: 177.1,19.05 179.01,20.95 181.29,20.95 v183.83,18.41 | 180.91,7.62 182.31,9.02 182.31,11.81 v183.83,13.33
B1  (1 unrouted)
  Bottom 0.406: D58.C 261.3,214.95 259.4,215.58 259.4,220.03 259.71,220.34 259.71,222.25 260.03,222.57 260.03,226.06 | 267.33,242.25 270.19,240.35 275.59,240.35 278.76,242.25 | 259.6,242.25 258.13,241.62 D52.C | 286.7,242.25 289.24,240.35 294.96,240.35 297.93,242.68
  Bottom 0.61: 297.93,242.68 307.02,242.68 D54.C 309.88,238.44 320.99,238.44 | 260.03,226.06 254,229.23 | 259.6,242.25 267.33,242.25 | 278.76,242.25 286.7,242.25 | 320.99,238.44 321.31,238.44 | 322.91,233.67 320.99,235.58 320.99,238.44
  Bottom 0.813: D52.C 254,238.55 D51.C | 321.31,238.44 327.45,240.14 D64B.C
  Bottom 1.016: 254,229.23 254,238.55
B2
  Bottom 0.61: J53.2 D60.C | 298.45,224.36 298.45,215.9 301.04,212.36 D61.C
  Bottom 0.813: 298.45,224.36 298.45,225.42 294,229.87 289.88,229.87 288.61,228.6 D53.C
  Bottom 1.016: 298.45,215.9 288.93,215.9 D60.C | J46.2 298.45,225.42
B2J
  Bottom 0.61: 251.98,199.39 255.59,199.39 257.81,201.61 263.21,201.61 266.7,203.52 266.7,207.01 268.92,211.45 268.92,214 270.51,215.9 279.4,215.9 280.99,213.68 J53.1
  Bottom 0.813: 251.98,199.39 249.87,201.61 D57.C
B3
  Bottom 0.61: D59.C 272.42,196.53 270.4,196.53 D65.C 264.05,192.2 260.35,197.17 251.46,197.17 247.65,191.45 244.79,191.45 241.73,196.74 231.98,196.74 228.28,192.4 226.38,192.4 223.52,196.21 222.57,196.85 218.44,196.85 | D49.C 211.25,194.42 213.68,196.85 218.44,196.85 | D56.C 218.44,196.85
  Bottom 1.016: D59.C J48.2
B3J
  Bottom 0.61: 303.21,201.93 301.85,201.93 J49.1 | 303.21,201.93 304.96,201.93 308.93,197.8 316.87,197.8 | D68.C 320.36,184.99 320.36,193.38 316.87,197.8 | D67B.C 303.21,201.93 | 316.87,197.8 320.45,201.38 J88.1
B4
  Bottom 0.61: D76.C 301.19,174.74 297.61,178.32
  Bottom 0.813: 288.29,176.62 289.47,177.8 295.59,177.8 D67.C | J91.1 298.25,181.93 D67.C | 297.61,178.32 D67.C
  Bottom 1.016: J50.1 288.29,176.62
B4J
  Bottom 0.61: J50.2 281.71,175.17 277.5,179.39 D66.C 274.75,177.48 269.88,177.48 266.7,174.31 D73.C 264.37,174.1 258.44,180.02 251.78,180.02 248.92,182.88 245.75,182.88 243.84,181.29 J54.2
B4J2
  Bottom 0.61: J54.1 237.26,180.02 234.31,180.02 227.97,173.67 226.81,173.67 D63.C 221.09,178.55 220.34,178.44 217.49,178.44 D55.C
B5
  Bottom 1.016: J51.1 285.5,154.53 289.88,159.39 | D75.C 289.88,159.39 | 289.88,159.39 294.09,159.39 J89.1
B5J
  Bottom 0.61: J51.2 280.28,157.35 279.19,158.43 269.88,158.43 | 269.88,158.43 267.33,155.89 264.48,155.89 259.71,160.97 250.98,160.97 248.13,164.15 244.95,164.15 | 269.88,158.43 D74.C | D64.C 239.65,177.87 241.94,176.85 244.79,173.35 245.11,173.04 244.95,164.15 | 244.95,164.15 241.78,160.65 232.73,160.65 232.09,161.29 229.66,163.4 D71.C 225.63,164.03 222.88,161.29 D62.C
B5J4
  Bottom 0.61: J92.1 325.44,161.29 323.85,160.02 309.88,160.02 304.8,164.15 303.21,164.15 299.72,162.24 J89.2
B5J5  (2 unrouted)
  Bottom 0.61: J92.2 335.92,161.85 335.92,173.04 339.41,176.21 342.58,179.07 344.17,179.07 347.03,181.93 347.03,201.3 348.62,202.88 342.9,218.12
B6
  Bottom 0.61: J55.2 274.52,139.27 D81.C 278.33,139.27 284.8,145.73 286.7,145.73 291.78,139.7
  Bottom 0.813: 291.78,139.7 297.18,139.7 D82.C
  Bottom 1.016: D82.C 301.1,146.05 D83.C J94.1
B6J2
  Bottom 0.61: 246.7,154.94 248.28,154.94 251.35,158.96 259.82,158.96 263.84,154.62 263.84,152.08 267.97,147.95 267.97,145.57 J55.1 | 246.7,154.94 244.47,154.94 241.53,158.84 D72.C | 246.7,154.94 246.7,149.54 243.21,146.05 241.53,144.78 J56.2
B6J3
  Bottom 0.61: J56.1 229.32,145.1 225.74,145.1 223.52,142.56 221.62,142.56 D70.C
B7  (1 unrouted)
  Bottom 0.61: 351.47,140.02 351.79,166.05 351.79,199.71 354.96,202.57 354.96,216.22 344.81,222.89 | 344.49,120.97 337.19,120.97 328.3,124.78 319.09,124.78 315.6,122.24 313.69,122.24 310.51,124.46 305.44,124.46 304.05,125.52 D87.C 295.7,120.97 291.04,120.97 282.57,124.98 D86.C 277.93,124.46 272.1,124.46 268.49,123.08 266.5,123.08 264.48,124.14 262.25,127 260.99,128.9 258.76,128.9 258.13,129.54 258.13,132.4 261.3,133.99 261.3,136.75 J52.1
  Bottom 1.016: 351.47,140.02 351.47,127.95 344.49,120.97
B7J
  Bottom 0.61: D77.C 209.75,144.26 214.31,139.7 222.04,139.7 D78.C 222.57,138.43 225.11,135.89 234.95,135.89 238.76,139.7 239.4,141.6 244.47,145.41 248.92,145.41 D80.C 251.78,139.38 253.37,139.38 J52.2
B8  (1 unrouted)
  Bottom 0.61: 349.25,139.7 349.25,152.4 350.52,158.75 350.52,163.83 349.88,165.1 349.88,170.18 350.52,171.13 350.52,174.31 350.2,176.21 350.2,200.34 353.38,203.52 353.38,215.58 344.17,220.34 | D88.C 343.65,123.62 342.58,122.56 336.23,122.56 331.56,124.69 J87.2
  Bottom 1.016: 349.25,139.7 349.25,130.38 D88.C
BD1
  Bottom 0.406: SV4.10 217.49,220.98 218.44,221.62 221.3,221.62 221.62,220.98 223.84,219.71 225.11,220.66 234.79,220.66 235.59,220.03 240.51,220.03 241.3,219.23 243.36,219.23 245.43,220.98 248.13,220.98 | 251.14,218.44 255.68,218.44 J70.2
  Bottom 0.61: 251.14,218.44 248.13,220.98
BD2
  Bottom 0.406: SV4.9 214.95,220.98 217.81,222.57 219.39,222.57 221.93,224.79 222.57,224.79 225.74,221.62 244.16,221.62 244.79,222.25 248.76,222.25 251.62,219.71 255.91,219.71 257.02,220.82 J71.2
BD3
  Bottom 0.406: SV4.8 212.41,221.62 213.68,222.57 215.26,222.57 217.49,223.52 219.07,223.52 221.62,225.74 222.88,225.74 226.06,222.57 243.52,222.57 244.47,223.52 249.24,223.52 | 252.25,220.82 254.95,220.82 256.38,221.77 J72.2
  Bottom 0.61: 252.25,220.82 249.24,223.52
CD1  (1 unrouted)
CD2  (1 unrouted)
CD3  (1 unrouted)
CMP  (1 unrouted)
  Top 0.305: RN1.8 151.38,19.62 | RN1.8 151.32,19.78 151.32,20.32 149.29,22.35 141.41,22.35 140.65,23.11 140.65,24.64 145.73,29.72 145.73,34.29 143.83,36.2 142.47,36.2 | C22.2 142.3,37.97 142.26,37.93 | RN1.8 152.15,19.62 152.34,19.43 152.34,18.92 152.23,18.82 RN1.7
D0/RX  (via drill 0.61)
  Bottom 0.305: v164.15,27.94 164.15,29.21 183.83,48.89
D1  (1 unrouted)
D1/TX
  Bottom 0.305: 162.88,29.21 181.29,47.63
D2  (1 unrouted)
D2/SDA  (via drill 0.61)
  Top 0.305: 165.72,28.27 164.15,29.84 162.88,29.84 v162.24,30.48 161.61,29.84 148.91,29.84 v148.27,30.48 | v141.92,42.55 141.92,50.55
  Bottom 0.305: v141.92,42.55 141.92,42.42 142.05,42.29 142.05,37.21 148.27,30.99 v148.27,30.48 | v162.24,30.48 162.88,30.48 178.75,46.35
D3  (1 unrouted)
D3/SCL  (via drill 0.61)
  Top 0.305: v138.75,42.55 139.13,42.93 | v148.53,32.39 150.43,30.48 159.7,30.48 v162.24,33.02 166.52,28.74
  Bottom 0.305: v138.75,42.55 140.02,43.82 142.56,43.82 143.19,43.18 143.19,41.91 142.81,41.4 142.81,37.59 148.02,32.39 v148.53,32.39 | v162.24,33.02 162.24,37.46 173.67,48.89 175.58,48.89 176.21,49.53
D4  (via drill 0.61)  (1 unrouted)
  Top 0.305: 159.07,23.75 159.07,19.69 159.84,18.91
  Bottom 0.305: v160.97,27.94 160.97,28.57 159.7,29.84 159.7,36.2 173.67,50.16
D5*  (via drill 0.61)  (1 unrouted)
  Top 0.305: 159.72,13.47 156.26,13.47 154.62,15.11 154.62,23.5 v151.45,26.67
  Bottom 0.305: 170.5,50.16 170.5,48.26 158.81,36.58 158.81,29.46 159.7,28.57 159.7,26.67 | 159.45,24.13 158.43,24.13 157.8,24.76 153.35,24.76 v151.45,26.67
D6*  (via drill 0.61)
  Top 0.305: 159.16,17.31 157.8,18.67 157.8,25.65 158.43,26.29 v158.43,27.94
  Bottom 0.305: v158.43,27.94 158.43,28.57 157.92,29.46 157.92,36.96 168.59,47.63
D7  (via drill 0.61)
  Top 0.305: v157.8,17.14 157.16,17.78 v157.16,26.67
  Bottom 0.305: 166.05,46.35 157.04,37.34 157.04,29.08 157.16,28.57 v157.16,26.67
D+
  Top 0.305: RN3.8 131.83,36.26 131.76,36.2 131.76,34.65 Z1.1
  Top 0.406: J47.P3 128.21,38.1 130.11,36.2 130.13,36.2 Z1.1
D-
  Top 0.305: RN3.5 131.83,38.66 131.76,38.74 131.76,40.27 Z2.1
  Top 0.406: Z2.1 130.79,38.76 J47.P2
G1
  Bottom 0.61: JA49.2 237.17,235.78 237.17,238.13 234.95,238.13 234.31,237.97 232.73,237.97 232.09,239.08 R17.2 229.55,239.08 227.65,239.08 226.69,240.35 224.16,240.35 222.57,243.52
  Bottom 0.813: JA49.2 237.36,229.36 239.71,226.38 2D2.9 | JA47.2 190.82,227.77 190.82,214.63 191.64,213.36
  Bottom 1.016: JA47.2 191.64,241.54 196.22,243.52 204.47,243.52 208.28,239.71 | 191.64,213.49 191.64,213.36 JA53.2 JA60.2 JA68.2 JA75.2 191.64,143 192.72,141.92 196.53,141.92 200.66,139.7 202.76,137.6 JA82.2 | 208.28,239.71 JA48.2 | 222.57,243.52 212.09,243.52 208.28,239.71
G2
  Bottom 0.61: JA56.2 245.43,204.47 242.25,201.61 JA55.2 238.76,200.34 238.76,198.12 232.57,198.12 228.28,202.88 224.79,202.88 | JA70.2 228.79,166.18 226.06,166.18 222.12,163.2 220.98,163.2 | 212.41,198.63 212.09,197.17 209.55,194.31 209.55,187.96 210.69,186.5 JA61.2 210.53,184.12 212.09,181.93 214.95,180.02 214.95,177.8 211.77,176.85 211.77,172.4 210.19,171.13 210.19,167.96 210.69,167.45 JA69.2 210.69,164.59 214.31,160.97 216.22,160.97 218.44,163.2 220.98,163.2 | 212.41,198.63 JA54.2 | 220.98,163.2 220.98,159.39 223.2,157.48 229.24,152.4 229.24,149.54 JA77.2 JA76.2 | 224.79,202.88 224.47,200.98 223.2,199.71 221.17,198.63 212.41,198.63 | J63.2 R18.2 224.79,205.74 224.79,202.88
G3
  Bottom 0.61: JA71.2 248.79,171.26 242.57,178.12 240.66,179.39 240.66,182.25 241.94,182.56 243.19,182.56 245.21,184.58
  Bottom 1.016: J57.2 JA62.2 | JA62.2 JA63.2 | 245.21,184.58 JA62.2
G4
  Bottom 0.406: J76.2 262.57,214.95 264.16,213.36 267.02,213.36 270.19,217.49
  Bottom 0.61: JA64.2 283.34,192.6 278.45,198.12 278.45,200.66 280.67,202.25 283.02,203.64 JA57.2 283.21,212.41 280.35,216.85 279.72,217.49 | JA72.2 283.21,175.58 280.35,178.44 280.35,180.66 | 279.72,161.61 279.72,160.18 283.69,154.31 283.69,147.83 JA79.2 283.65,146.65 277.65,140.65 275.27,140.65 273.05,142.24 270.83,140.02 270.19,140.02 268.92,141.29 268.92,142.56 266.06,145.41 261.94,145.41 260.54,143.07 JA78.2 259.84,137.67 259.84,135.57 256.22,133.86 JA87.2 | 270.19,217.49 279.72,217.49 | JA51.2 275.46,227.77 277.18,226.06 278.76,226.06 279.4,225.42 279.4,217.81 279.72,217.49
  Bottom 1.016: JA51.2 JA50.2 | JA64.2 283.34,183.96 280.35,180.66 | JA72.2 283.34,165.23 279.72,161.61
G5
  Bottom 0.406: 311.47,232.11 311.47,235.58 J62.2
  Bottom 0.61: JA80.2 303.02,153.54 297.81,159.39 297.81,162.88 298.45,163.51 299.72,164.15 302.07,165.23 JA73.2 302.39,169.35 303.02,169.99 303.02,174.82 299.4,178.44 299.4,180.66 301.75,182.37 303.34,182.69 JA65.2 | 297.18,201.61 299.72,201.61 301.31,204.47 301.31,206.38 302.55,208.41 302.89,208.76 302.89,212.09 301.31,214.31 301.31,216.85 303.21,218.12 303.21,226.38 JA52.2 307.64,228.28 311.47,232.11 | 297.18,201.61 295.4,201.61 JA58.2 | 303.34,191.96 299.21,196.41 297.18,196.53 297.18,201.61 | JA83.2 279.08,126.68 281.94,126.68 289.56,122.87 295.27,122.87 299.85,127.44 JA84.2 299.85,135.38 300.99,136.52 306.07,136.52 308.93,139.38 308.93,147.32 307.66,148.59 JA80.2 | 302.89,148.46 JA80.2
  Bottom 1.016: JA66.2 JA65.2 303.34,191.96
G6  (5 unrouted)